# EAGLE design harp behavior poke port breakout v1.1 (EAGLE 6.5.0)
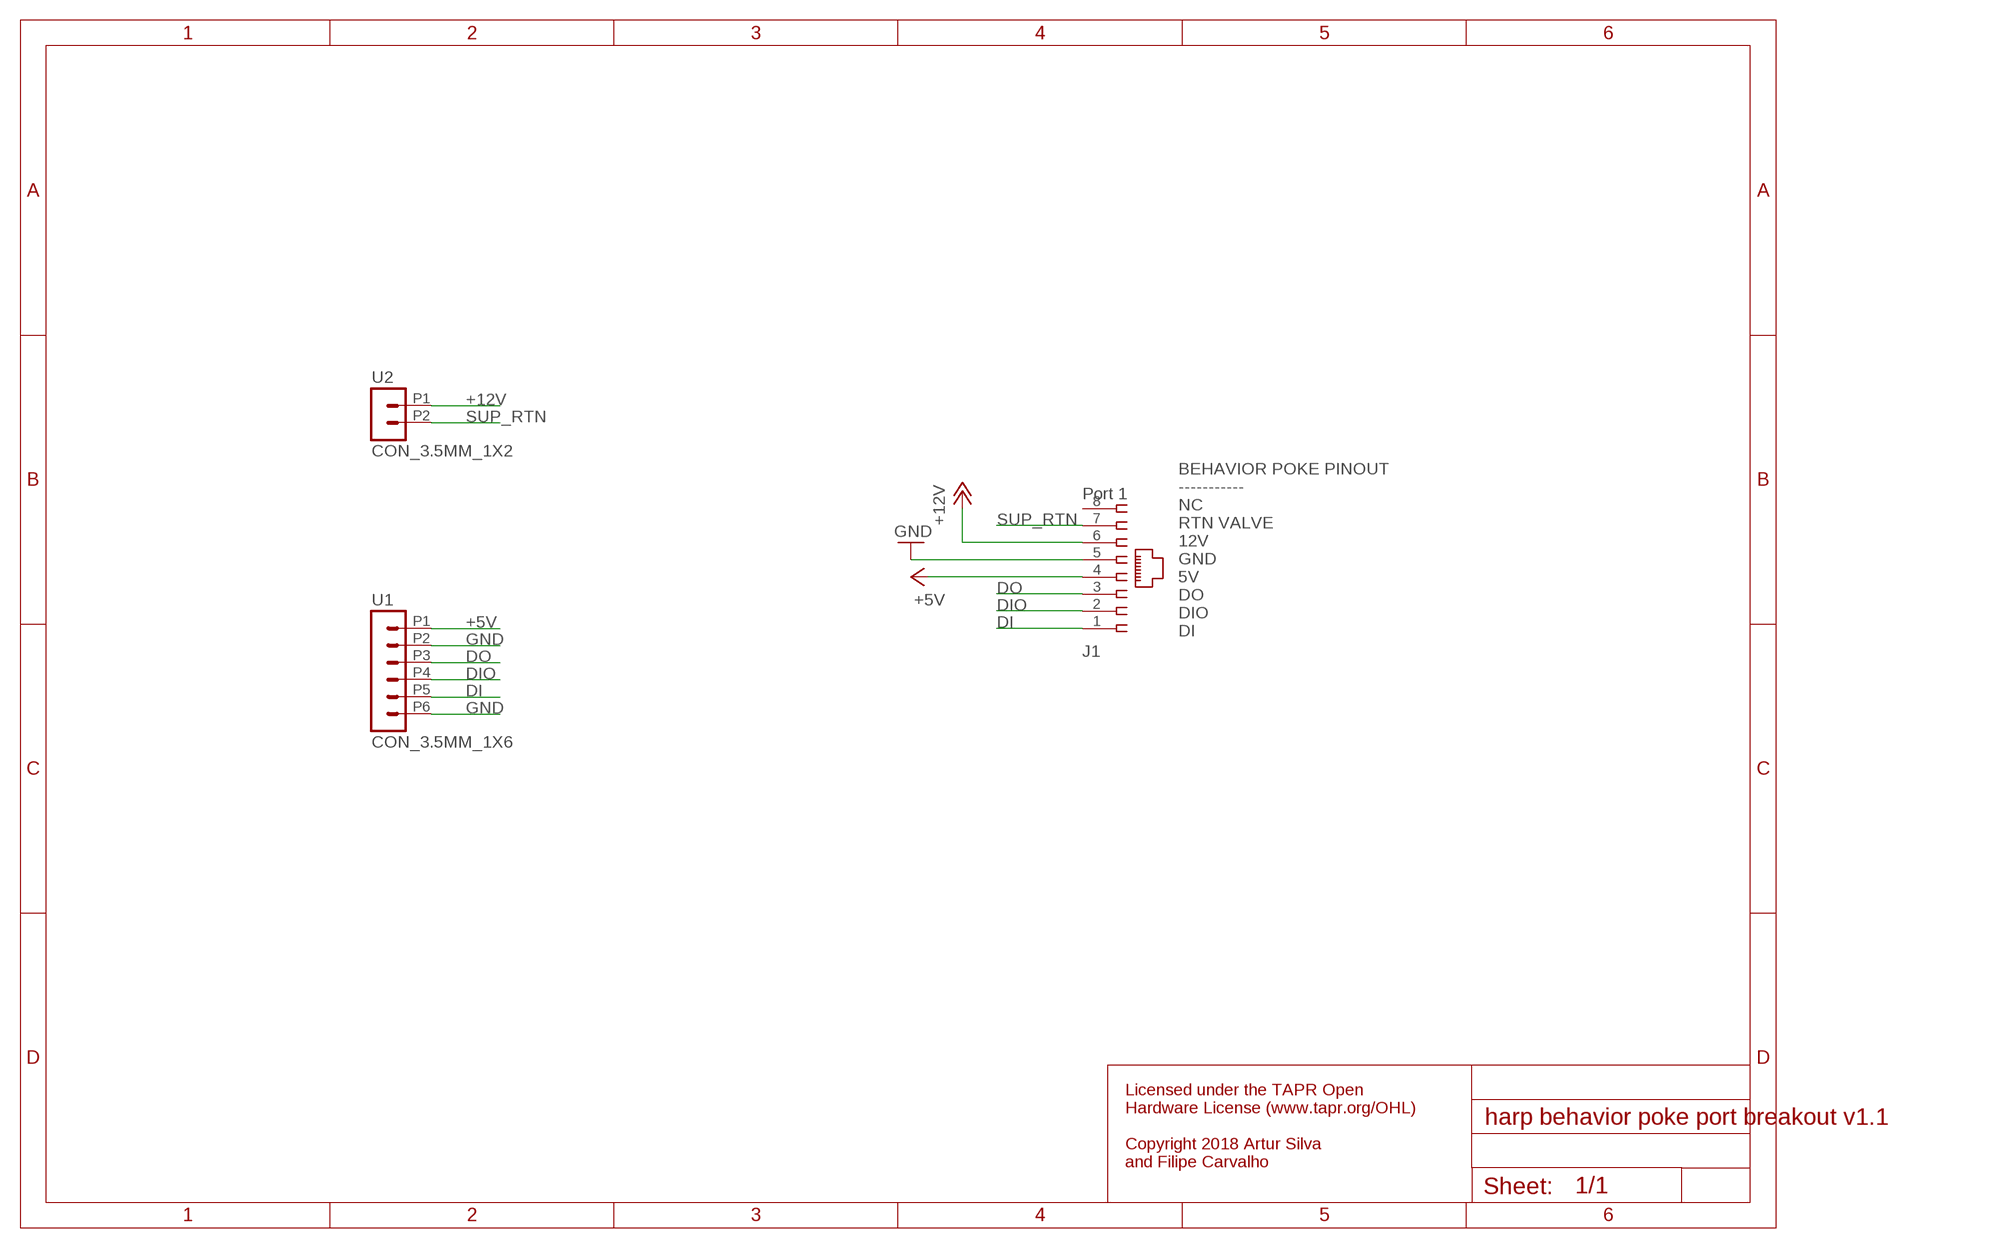
[diagram p0: schematic, sheet 1]

## Parts
J1  Port 1  520426-4  [520426-4]
U1  CON_3.5MM_1X6  [CON_3.5MM_1X6]
U2  CON_3.5MM_1X2  [CON_3.5MM_1X2]

## Nets
+5V: J1.4 U1.P1
+12V: J1.6 U2.P1
DI: J1.1 U1.P5
DIO: J1.2 U1.P4
DO: J1.3 U1.P3
GND: J1.5 U1.P2 U1.P6
SUP_RTN: J1.7 U2.P2
Unconnected: J1.8

## Notes on the sheet
- BEHAVIOR POKE PINOUT
  -----------
  NC
  RTN VALVE
  12V
  GND
  5V
  DO
  DIO
  DI
- Licensed under the TAPR Open 
  Hardware License (www.tapr.org/OHL)
  
  Copyright 2018 Artur Silva 
  and Filipe Carvalho

## Library data of the parts
J1 = con-amp:520426-4: AMP connector
U1 = CNP-connectors:CON_3.5MM_1X6
U2 = CNP-connectors:CON_3.5MM_1X2

## Board
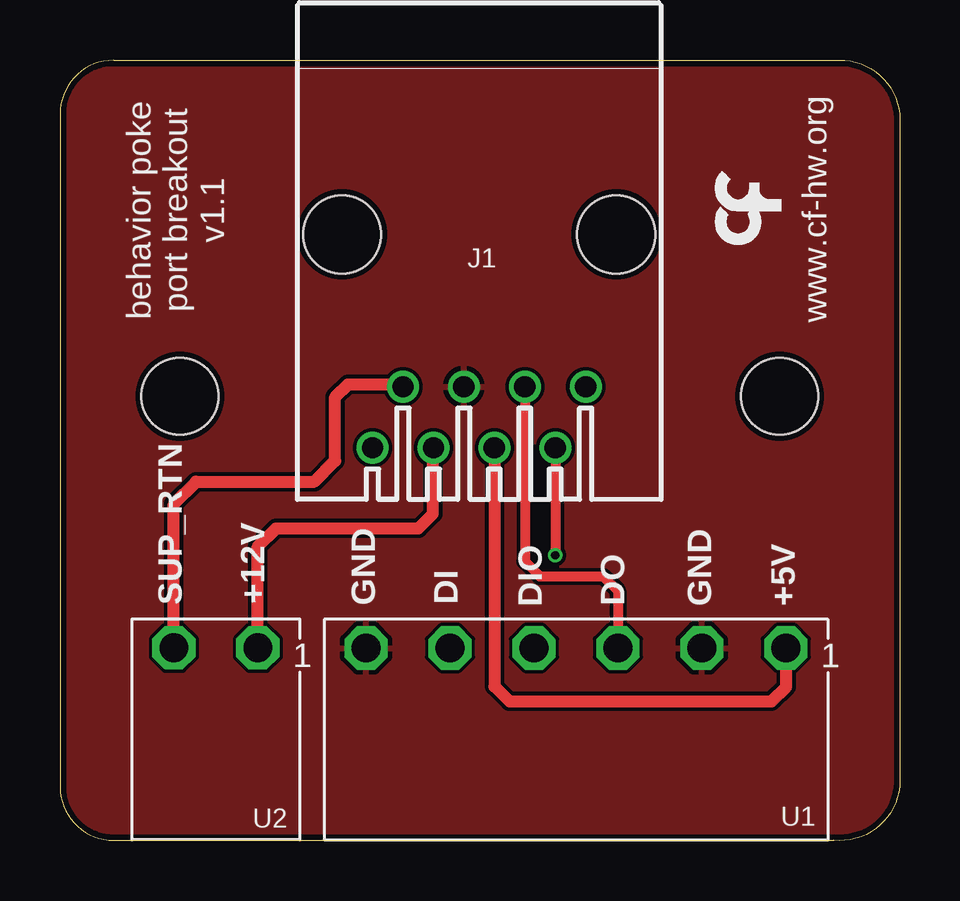
[diagram p1: board, top side]
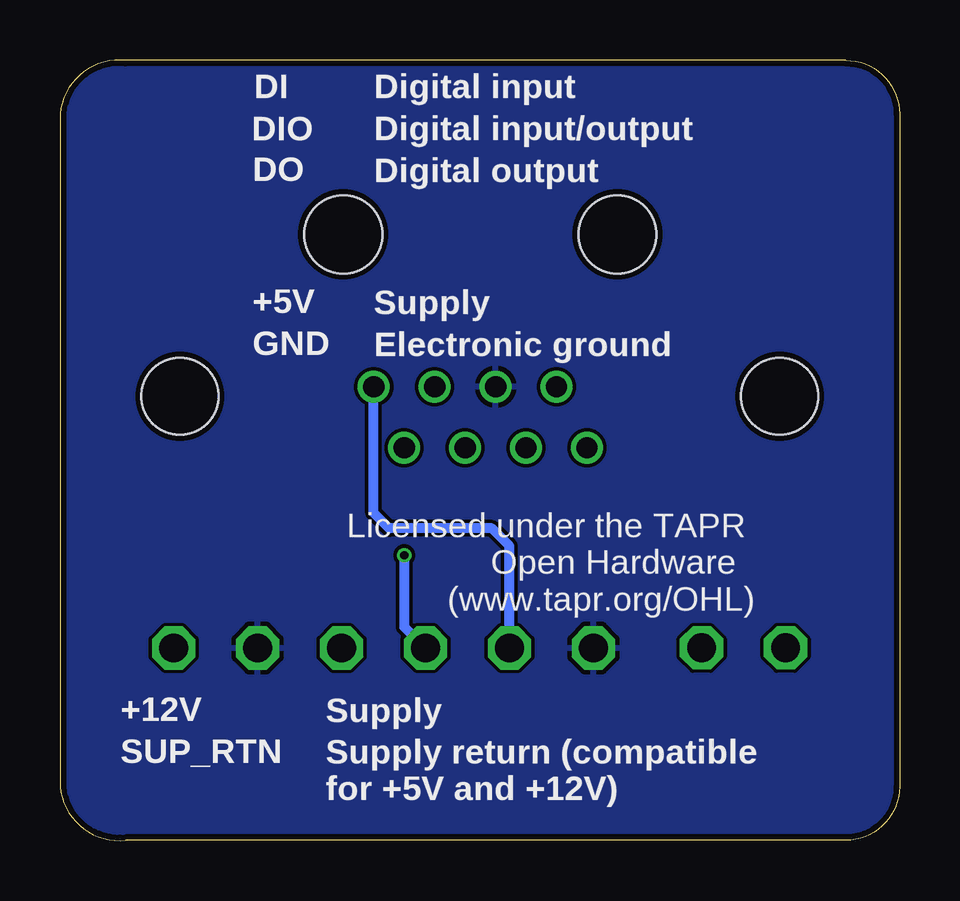
[diagram p2: board, bottom side, seen from below]

Size 35 x 32.52 mm. Coordinates in mm from the lower left corner, seen from the top.
Outline: 2.24,32.51 32.26,32.51 arc-90 35,30.28 35,2.25 arc-90 32.26,0.01 2.24,0.01 arc-90 0,2.25 0,30.28 arc-90 2.24,32.51
Copper layers (1*16): Top 0.018mm / dielectric 1.55mm / Bottom 0.018mm
Design rules "eC_2Layer_PClass6_BaseCopperO18_eCDefault *": minimum track width 0.15mm, minimum drill 0.3mm, track to track 0.15mm, track to pad 0.15mm, pad to pad 0.15mm, via to via 0.15mm, smd to smd 0mil, copper to edge 0.25mm, drill to drill 0.35mm, minimum pad ring 0.175mm, minimum via ring 0.125mm, stop-mask expansion 0mil, vias tented up to drill 0.45mm, thermal gap 0.2mm
Holes 3.2 mm at 30,18.51 5,18.51

### Footprints (pad centres in the part's own frame; a part is rotated, then mirrored left to right if it is on the bottom)
520426-4 = drill 0.889: 1 -4.445,6.35; 2 -3.175,8.89; 3 -1.905,6.35; 4 -0.635,8.89; 5 0.635,6.35; 6 1.905,8.89; 7 3.175,6.35; 8 4.445,8.89 | hole 3.251: -5.715,0; 5.715,0
CON_3.5MM_1X6 = drill 1.2 octagon: P1 -8.44,-2.54; P2 -4.94,-2.54; P3 -1.44,-2.54; P4 2.06,-2.54; P5 5.56,-2.54; P6 9.06,-2.54
CON_3.5MM_1X2 = drill 1.2 octagon: P1 -1.75,0; P2 1.75,0

### Placement (x,y rotation side)
J1  17.48,25.26 180 top
U1  21.82,5.48 180 top
U2  6.5,8.03 180 top
U$2  [LOGO_8]  28.25,25.76 90 top

### Tracks (layer width: path | path; a pad name or v marks a point on that pad's centre or on a via)
+5V
  Top 0.508: J1.4 18.11,6.43 18.74,5.8 29.66,5.8 30.27,6.41 30.27,8.01 U1.P1
+12V
  Top 0.508: U2.P1 8.25,12.26 9,13.01 14.94,13.01 15.55,13.62 15.55,16.35
  Top 0.61: 15.55,16.35 J1.6
DI
  Bottom 0.406: U1.P5 16.26,12.27 17,13.01 21.28,13.01 21.92,13.65 J1.1
DIO  (via drill 0.35 pad 0.6)
  Top 0.406: J1.2 v20.65,11.89
  Bottom 0.406: v20.65,11.89 20.65,8.91 U1.P4
DO
  Top 0.406: J1.3 19.38,11.63 20,11.01 22.64,11.01 23.25,10.4 U1.P3
GND
  pour Bottom: 35,0.01 0,0.01 0,32.51 35,32.46
  pour Top: 35,0.01 0,0.01 0,32.51 35,32.51
SUP_RTN
  Top 0.508: U2.P2 4.75,14.04 5.67,14.96 10.61,14.96 11.47,15.82 11.47,18.49 12,19.01 14.2,19.01 J1.7

### Text on the board
tPlace: behavior poke / port breakout / v1.1 | www.cf-hw.org | SUP_RTN | +12V | GND | DI | DIO | DO | GND | +5V | Licensed under the TAPR Open / Hardware License (www.tapr.org/OHL) / / Copyright 2018 Artur Silva and Filipe Carvalho
bPlace: Digital input | DI | Digital input/output | DIO | Digital output | DO | Supply | +5V | Electronic ground | GND | Licensed under the TAPR / Open Hardware / (www.tapr.org/OHL) | Supply | +12V | SUP_RTN | Supply return (compatible / for +5V and +12V)